# EAGLE design Breadboard Power Supply - SMD (EAGLE 6.4)
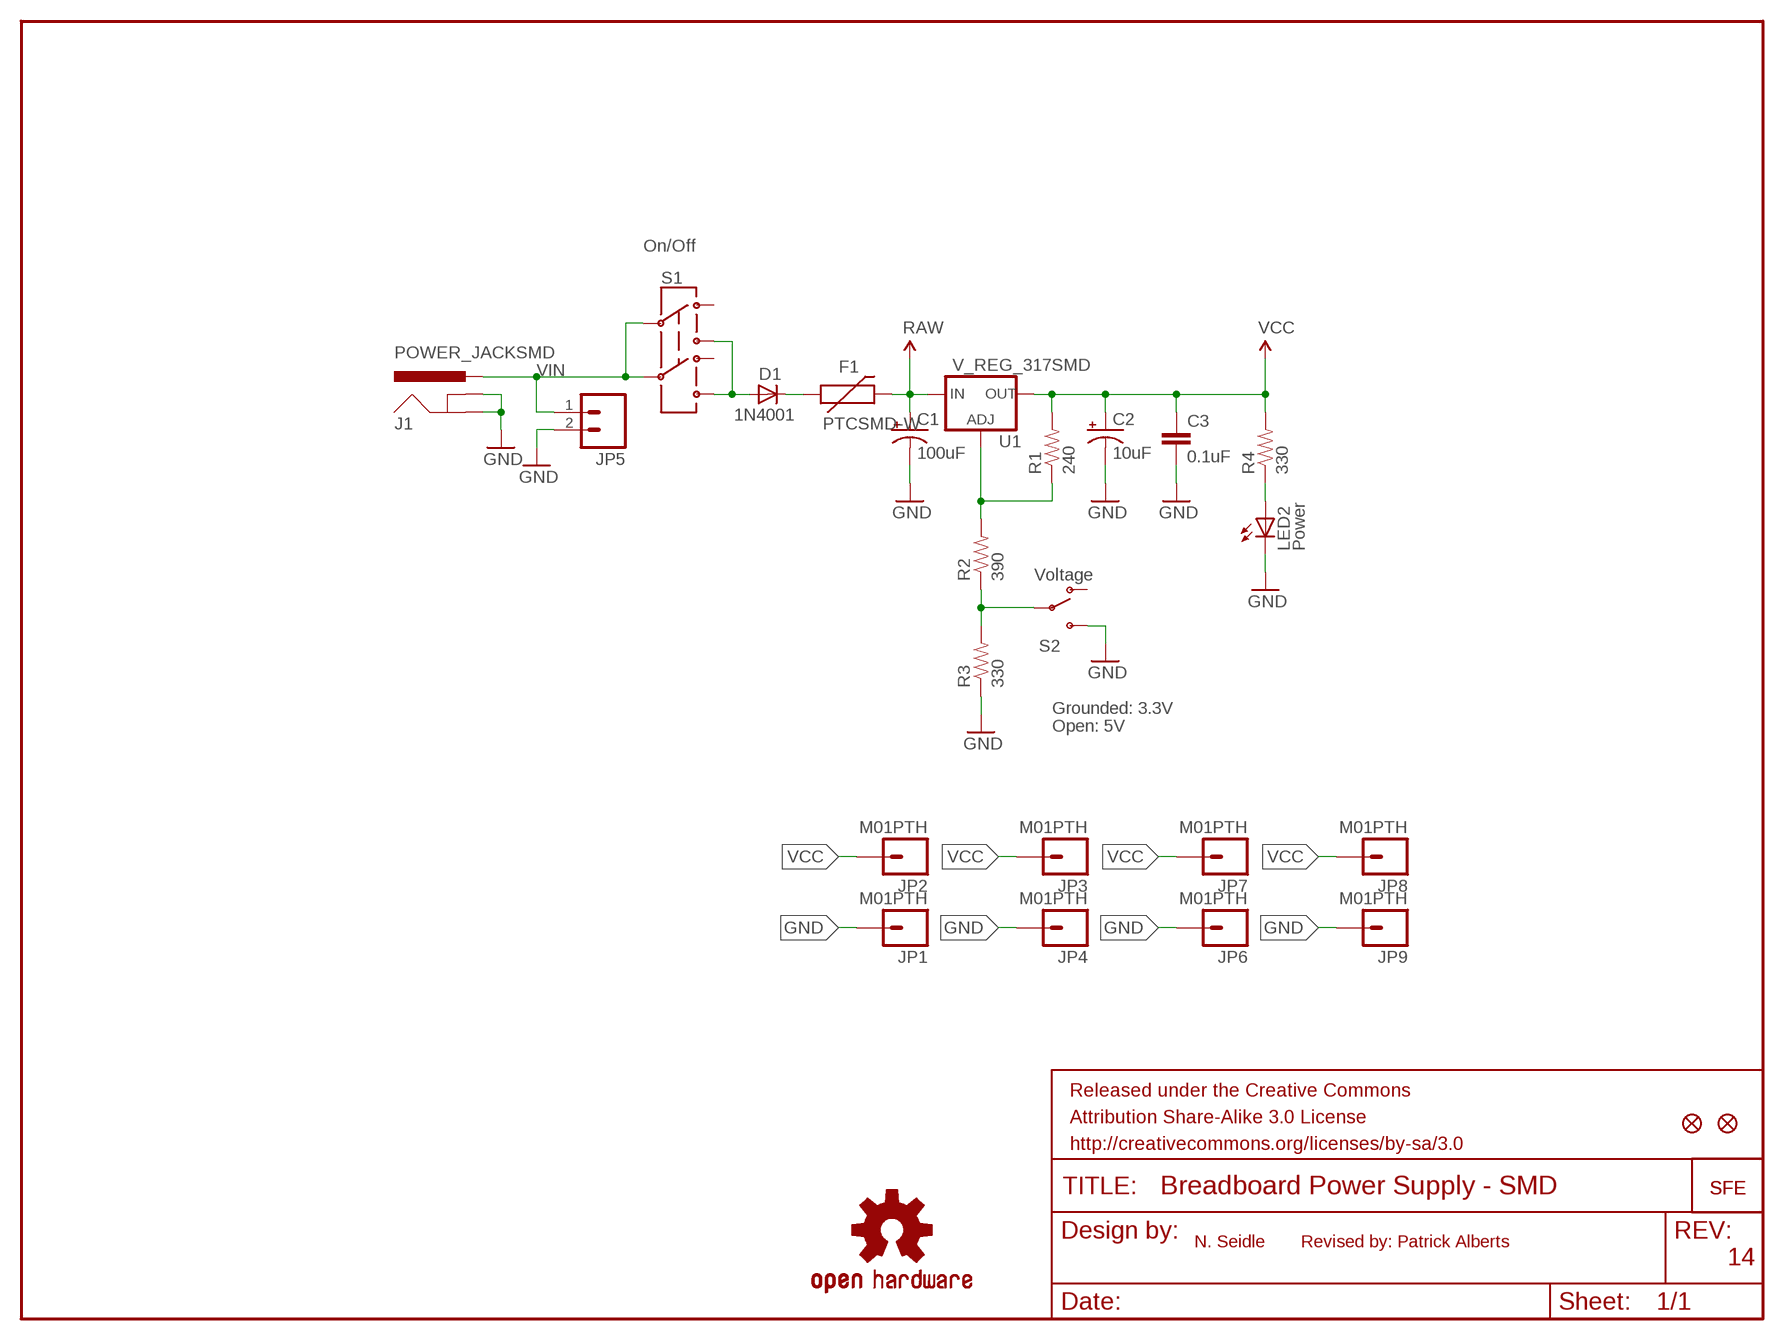
[diagram p0: schematic, sheet 1]

## Parts
C1  100uF  CAP_POL7343  [EIA7343]
C2  10uF  CAP_POL1206  [EIA3216]
C3  0.1uF  CAP0603-CAP  [0603-CAP]
D1  1N4001  DIODESMA-TYLERALT1  [SMA-DIODE-TYLERALT1]
F1  PTCSMD-W  [PTC-1206-WIDE]
FRAME1  FRAME-LETTER  [CREATIVE_COMMONS]
J1  POWER_JACKSMD  [POWER_JACK_SMD]
JP1  M01PTH  [1X01]
JP2  M01PTH  [1X01]
JP3  M01PTH  [1X01]
JP4  M01PTH  [1X01]
JP5  M02PTH  [1X02]
JP6  M01PTH  [1X01]
JP7  M01PTH  [1X01]
JP8  M01PTH  [1X01]
JP9  M01PTH  [1X01]
LED2  Power  LED1206  [LED-1206]
LOGO1  OSHW-LOGOS  [OSHW-LOGO-S]
R1  240  RESISTOR0603-RES  [0603-RES]
R2  390  RESISTOR0603-RES  [0603-RES]
R3  330  RESISTOR0603-RES  [0603-RES]
R4  330  RESISTOR0603-RES  [0603-RES]
S1  On/Off  AYZ0202  [AYZ0202]
S2  Voltage  SWITCH-SPSTSMD  [AYZ0202]
U1  V_REG_317SMD  [SOT223]
U$1  LOGO-SFESK  [SFE-LOGO-FLAME]
U$2  LOGO-SFENEW  [SFE-NEW-WEBLOGO]
U$3  FIDUCIAL1X2  [FIDUCIAL-1X2]
U$4  FIDUCIAL1X2  [FIDUCIAL-1X2]

## Nets
GND: C1.C(-) C2.C(-) C3.2 J1.GND(GNDBREAK) J1.P$4(GND) JP1.1 JP4.1 JP5.2 JP6.1 JP9.1 LED2.C R3.1 S2.3(S)
N$1: D1.C F1.1
N$2: D1.A S1.1 S1.4
N$4: R2.1 R3.2 S2.2(P)
N$5: R1.1 R2.2 U1.1(ADJ)
N$8: LED2.A R4.1
RAW: C1.A(+) F1.2 U1.3(IN)
VCC: C2.A(+) C3.1 JP2.1 JP3.1 JP7.1 JP8.1 R1.2 R4.2 U1.2(OUT)
VIN: J1.VIN0(PWR) JP5.1 S1.2 S1.5
Unconnected: S1.3 S1.6 S2.1(O)

## Notes on the sheet
- Grounded: 3.3V
- Open: 5V
- N. Seidle | Revised by: Patrick Alberts
- 14

## Library data of the parts
C1 C2 = SparkFun:CAP_POL: Capacitor Polarized These are standard SMD and PTH capacitors. Normally 10uF, 47uF, and 100uF in electrolytic and tantalum varieties. Always verify the external diameter of the through hole cap, it varies with capacity, voltage, and manufacturer. The EIA devices should be standard.
C3 = SparkFun:CAP: Capacitor Standard 0603 ceramic capacitor, and 0.1" leaded capacitor.
D1 = Testing:DIODE: Diode These are standard reverse protection diodes and small signal diodes. SMA package can handle up to about 1A. SOD-323 can handle about 200mA. What the SOD-323 package when ordering, there are some mfgs out there that are 5-pin packages.
F1 = SparkFun-PowerIC:PTC: Resettable Fuse PTC Resettable Fuse. Spark Fun Electronics SKU : COM-08357
FRAME1 = SparkFun-Aesthetics:FRAME-LETTER: Schematic Frame Standard 8.5x11 US Letter frame
J1 = SparkFun-Connectors:POWER_JACK: Power Jack This is the standard 5.5mm barrel jack for power. The PTH is the most common, proven, reliable, footprint. The Slot footprint only works if the mill layer is transmitted to the PCB fab house so be warned. Mating wall wart : TOL-00298 (and others); PROD_ID: CONN-08106; VALUE: 5.5x2.1mm Barrel
JP1-JP4 JP6-JP9 = SparkFun:M01: Header 1 Standard 1-pin 0.1" header. Use with straight break away headers (SKU : PRT-00116), right angle break away headers (PRT-00553), swiss pins (PRT-00743), machine pins (PRT-00117), and female headers (PRT-00115).
JP5 = SparkFun:M02: Header 2 Standard 2-pin 0.1" header. Use with straight break away headers (SKU : PRT-00116), right angle break away headers (PRT-00553), swiss pins (PRT-00743), machine pins (PRT-00117), and female headers (PRT-00115). Molex polarized connector foot print use with SKU : PRT-08233 with associated crimp pins and housings.
LED2 = SparkFun-Nate:LED
LOGO1 = SparkFun-Aesthetics:OSHW-LOGO: Open Source Hardware Logo This logo indicates the piece of hardware it is found on incorporates a OSHW license and/or adheres to the definition of open source hardware found here: http://freedomdefined.org/OSHW
R1-R4 = SparkFun:RESISTOR: Resistor Basic schematic elements and footprints for 0603, 1206, and PTH resistors.
S1 = SparkFun:AYZ0202: SPDT Slide Switch Simple SMD single-pull double-throw slide switch. Good for less than 350mA power switch, switching UARTs between devices, etc. Spark Fun Electronics SKU : COM-00597
S2 = SparkFun:SWITCH-SPST: SPST Switch Simple slide switch. Spark Fun Electronics SKU : COM-00102
U1 = SparkFun:V_REG_317: Voltage Regulator Standard LM317 adjustable voltage regulator. AOI (Adjust Output Input). Google 'LM317 Calculator' for easy to use app to get the two resistor values needed. 240/720 for 5V output. 240/390 for 3.3V output. Spark Fun Electronics SKU : COM-00527
U$1 U$2 = SparkFun:LOGO-SFE: Spark Fun Electronics PCB Logo This is the standard Spark Fun Electronics PCB logo.
U$3 U$4 = SparkFun:FIDUCIAL: Fiducial Alignment Points Various fiducial points for machine vision alignment.

## Net classes
0 default: width 0.203 mm
1 power: width 0.508 mm

## Board
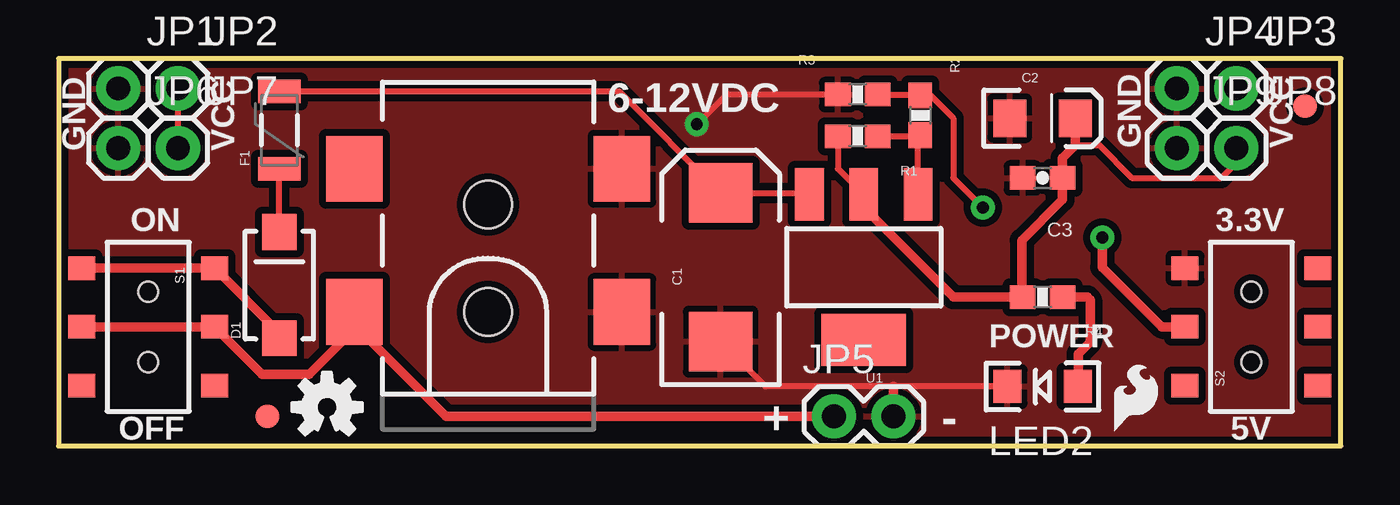
[diagram p1: board, top side]
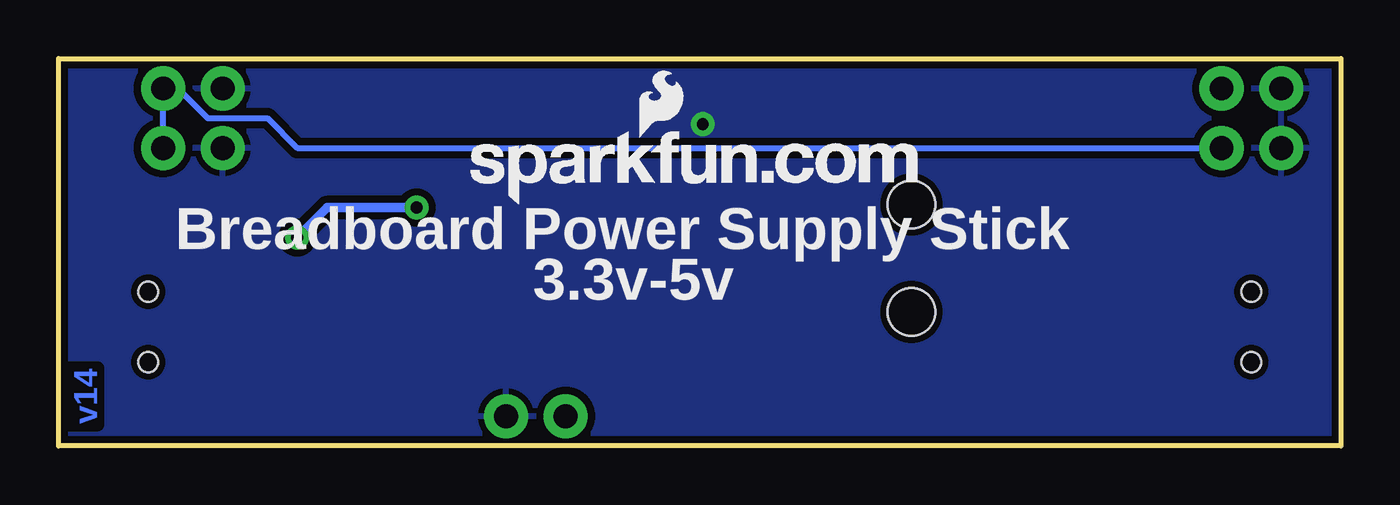
[diagram p2: board, bottom side, seen from below]

Size 54.61 x 16.51 mm. Coordinates in mm from the lower left corner, seen from the top.
Outline: 0,0 54.61,0 54.61,16.51 0,16.51 0,0
Copper layers (1*16): Top 0.035mm / dielectric 1.5mm / Bottom 0.035mm
Design rules "SparkFun *": minimum track width 8mil, minimum drill 20mil, track to track 8mil, track to pad 8mil, pad to pad 8mil, via to via 8mil, smd to smd 8mil, copper to edge 10mil, drill to drill 8mil, minimum pad ring 12mil, minimum via ring 10mil, stop-mask expansion 4mil, vias tented up to drill 20mil, thermal gap 10mil

### Footprints (pad centres in the part's own frame; a part is rotated, then mirrored left to right if it is on the bottom)
EIA7343 = smd 2.55 x 2.7: A 3.17,0; C -3.17,0
EIA3216 = smd 1.4 x 1.6: A 1.4,0; C -1.4,0
0603-CAP = smd 1.1 x 1: 1 -0.85,0; 2 0.85,0
SMA-DIODE-TYLERALT1 = smd 1.524 x 1.47: A -2.261,0; C 2.261,0
PTC-1206-WIDE = smd 1 x 1.8: 1 -1.654,0; 2 1.654,0
POWER_JACK_SMD = smd 2.8 x 2.4: GND 0,-5.7; P$4 6.1,-5.7; VIN0 0,5.7; VIN1 6.1,5.7 | hole 2.032: 0,0; 4.572,0
1X01 = drill 1.016 pad 1.88: 1 0,0
1X02 = drill 1.016 pad 1.88: 1 0,0; 2 2.54,0
LED-1206 = smd 1.2 x 1.4: A -1.5,0; C 1.5,0
0603-RES = smd 1.1 x 1: 1 -0.85,0; 2 0.85,0
AYZ0202 = smd 1 x 1.15: 1 -2.5,2.825; 2 0,2.825; 3 2.5,2.825; 4 -2.5,-2.825; 5 0,-2.825; 6 2.5,-2.825 | hole 0.85: 1.5,0; -1.5,0
SOT223 = smd 1.219 x 2.235: 1 -2.311,-3.099; 2 0,-3.099; 3 2.311,-3.099 | smd 3.6 x 2.2: 4 0,3.099
FIDUCIAL-1X2 = smd 1 x 1: 1 0,0

### Placement (x,y rotation side)
C1  28.19,7.62 90 top
C2  41.91,13.97 0 top
C3  41.91,11.43 180 top
D1  9.4,6.86 90 top
F1  9.4,13.46 90 top
FRAME1  -107.42,0 0 top  (outside the outline)
J1  18.29,5.71 90 top
JP1  2.54,15.24 0 top
JP2  5.08,15.24 0 top
JP3  50.16,15.24 0 top
JP4  47.62,15.24 0 top
JP5  33.02,1.27 0 top
JP6  2.54,12.7 0 top
JP7  5.08,12.7 0 top
JP8  50.16,12.7 0 top
JP9  47.62,12.7 0 top
LED2  41.91,2.54 180 top
LOGO1  11.43,1.65 0 top
R1  34.04,13.21 180 top
R2  36.7,14.1 270 top
R3  34.04,14.99 0 top
R4  41.91,6.35 180 top
S1  3.81,5.08 270 top
S2  50.8,5.08 90 top
U1  34.29,7.62 180 top
U$1  44.96,0.64 0 top
U$2  37.08,10.29 0 bottom
U$3  8.89,1.27 0 top
U$4  53.09,14.48 0 top

### Tracks (layer width: path | path; a pad name or v marks a point on that pad's centre or on a via)
GND  (via drill 0.51)
  Top 0.254: LED2.C 35.56,2.54 30.1,2.54 C1.C | R3.1 28.45,14.99 v27.18,13.72
  Top 0.406: 35.56,2.54 JP5.2
  pour Bottom (isolate 0.305): 0,16.51 54.61,16.51 54.61,0 0,0
  pour Top (isolate 0.305): 0,0 0,16.51 54.61,16.51 54.61,0
N$1
  Top 0.254: D1.C F1.1
N$2
  Top 0.406: S1.4 S1.1 9.4,4.82 D1.A
N$4  (via drill 0.51)
  Top 0.254: v39.37,10.16 38.1,11.43 38.1,13.97 37.12,14.95 R2.1 36.66,14.99 R3.2
  Top 0.406: S2.2 46.99,5.08 44.45,7.62 v44.45,8.89
  Bottom 0.406: v39.37,10.16 43.18,10.16 v44.45,8.89
N$5
  Top 0.254: U1.1 36.6,13.14 R2.2 36.66,13.21 R1.1
N$8
  Top 0.406: 43.05,6.35 R4.1 43.81,6.35 43.94,6.22 43.94,4.45 43.43,3.94 43.43,2.56 LED2.A
RAW
  Top 0.254: F1.2 23.87,15.12 C1.A 31.91,10.79 U1.3
VCC
  Top 0.254: JP7.1 JP2.1 | R1.2 33.19,11.82 U1.2 | 43.31,12.83 44.32,12.83 45.72,11.43 49.53,11.43 50.16,12.06 JP8.1
  Top 0.406: C2.A 43.18,13.97 | U1.2 34.29,10.16 38.1,6.35 R4.2 41.02,6.39 41.02,8.76 42.76,10.5 C3.1 42.76,12.28 43.31,12.83 C2.A | 43.56,13.72 arc-90 C2.A
  Bottom 0.254: JP7.1 44.45,12.7 45.72,13.97 48.26,13.97 49.53,15.24 JP3.1 JP8.1
VIN
  Top 0.406: S1.5 S1.2 8.67,3.05 10.67,3.05 12.7,5.08 | JP5.1 16.51,1.27 12.7,5.08 | J1.VIN0 12.59,5.19 12.7,5.08

### Text on the board
Bottom: v14
tPlace: 6-12VDC | GND | VCC | GND | VCC | ON | 3.3V | POWER | + | - | OFF | 5V
bPlace: Breadboard Power Supply Stick | 3.3v-5v
tValues: N. Seidle | Revised By: T Talmage